# EAGLE design T10_ChargerBase (EAGLE 7.2.0)
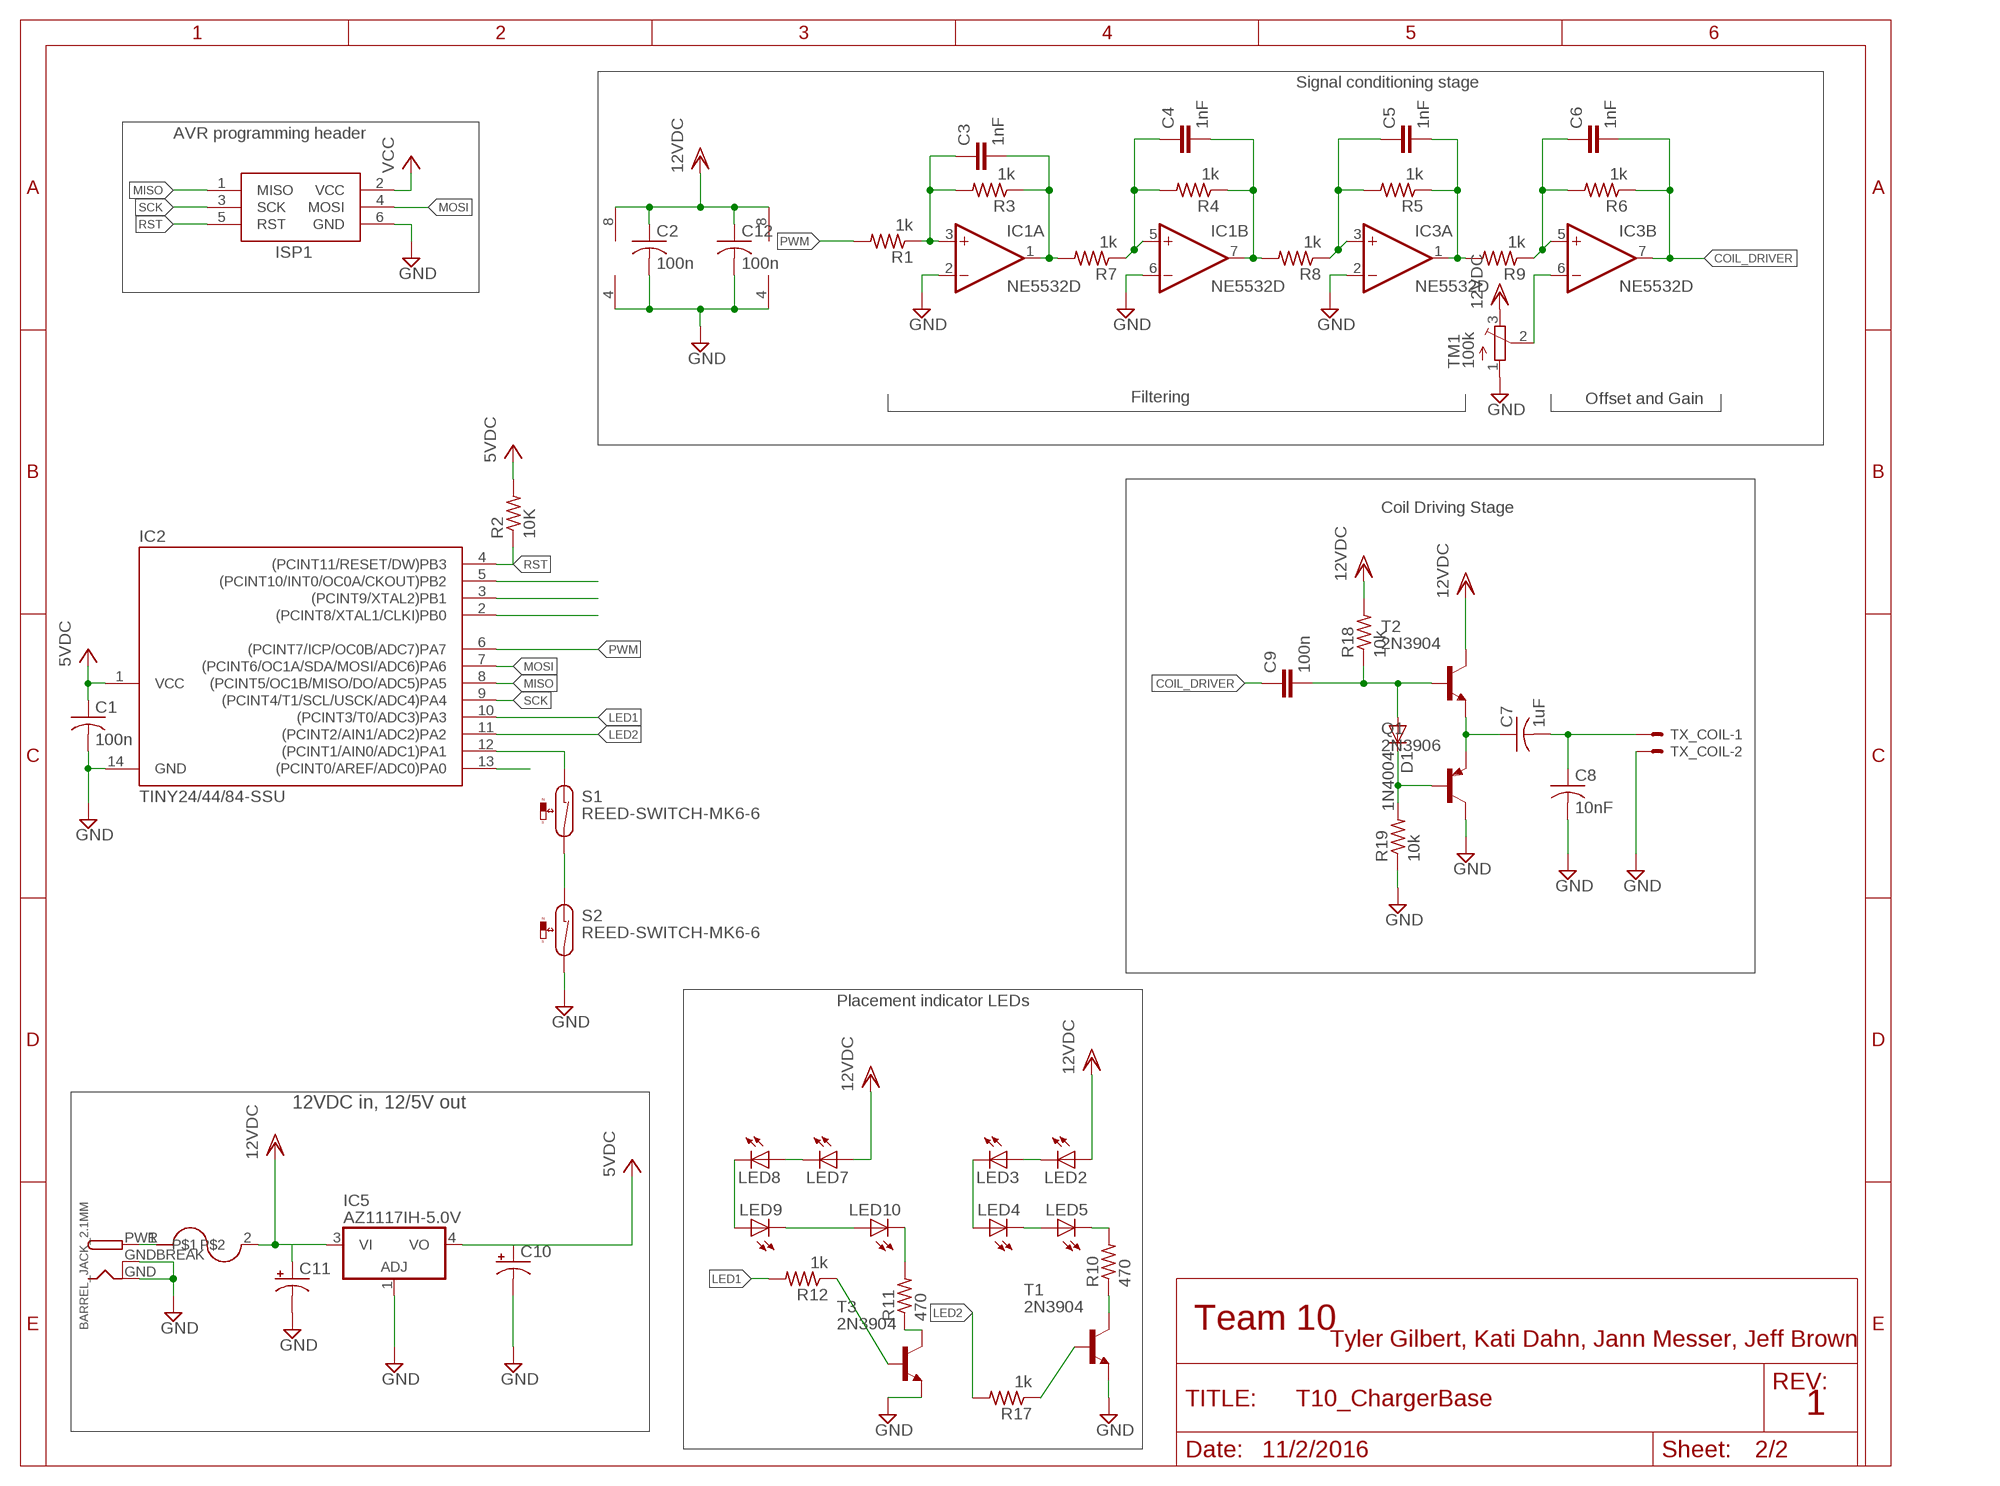
[diagram p0: schematic, sheet 1]

## Parts
BARREL_JACK_2.1MM  DCBARRELPTH  [DCJACK_2MM_PTH]
C1  100n  C-USC0805  [C0805]
C2  100n  C-USC0805  [C0805]
C3  1nF  C-EUC0805  [C0805]
C4  1nF  C-EUC0805  [C0805]
C5  1nF  C-EUC0805  [C0805]
C6  1nF  C-EUC0805  [C0805]
C7  1uF  C-US050-025X075  [C050-025X075]
C8  10nF  C-US050-025X075  [C050-025X075]
C9  100n  C-EUC0805  [C0805]
C10  CPOL-USE2-5  [E2-5]
C11  CPOL-USE2-5  [E2-5]
C12  100n  C-USC0805  [C0805]
D1  1N4004  [DO41-10]
IC1  NE5532D  [SO08]
IC2  TINY24/44/84-SSU  [SOIC14]
IC3  NE5532D  [SO08]
IC5  AZ1117IH-5.0V  317EMP  [SOT223]
ISP1  AVRISP-6  [AVRISP]
LED2  LEDCHIPLED_0805  [CHIPLED_0805]
LED3  LEDCHIPLED_0805  [CHIPLED_0805]
LED4  LEDCHIPLED_0805  [CHIPLED_0805]
LED5  LEDCHIPLED_0805  [CHIPLED_0805]
LED7  LEDCHIPLED_0805  [CHIPLED_0805]
LED8  LEDCHIPLED_0805  [CHIPLED_0805]
LED9  LEDCHIPLED_0805  [CHIPLED_0805]
LED10  LEDCHIPLED_0805  [CHIPLED_0805]
Q1  2N3906  [TO92]
R1  1k  R-US_R0805  [R0805]
R2  10K  R-US_R0805  [R0805]
R3  1k  R-US_R0805  [R0805]
R4  1k  R-US_R0805  [R0805]
R5  1k  R-US_R0805  [R0805]
R6  1k  R-US_R0805  [R0805]
R7  1k  R-US_R0805  [R0805]
R8  1k  R-US_R0805  [R0805]
R9  1k  R-US_R0805  [R0805]
R10  470  R-US_R0805  [R0805]
R11  470  R-US_R0805  [R0805]
R12  1k  R-US_R0805  [R0805]
R17  1k  R-US_R0805  [R0805]
R18  10k  R-US_R0805  [R0805]
R19  10k  R-US_R0805  [R0805]
S1  REED-SWITCH-MK6-6  [MK6-6]
S2  REED-SWITCH-MK6-6  [MK6-6]
T1  2N3904  [TO92]
T2  2N3904  [TO92]
T3  2N3904  [TO92]
TM1  100k  TRIMPOTTC33X  [TC33X]
TX_COIL  22-23-2021  [22-23-2021]
U$1  LITTLEFUSE  [LITTLEFUSE]

## Nets
COIL_DRIVER: C6.2 C9.1 IC3.7(B:OUT) R6.1
GND: BARREL_JACK_2.1MM.GND BARREL_JACK_2.1MM.GNDBREAK C1.2 C2.2 C8.2 C10.- C11.- C12.2 IC1.2(A:-IN) IC1.4(P:V-) IC1.6(B:-IN) IC2.14(GND) IC3.2(A:-IN) IC3.4(P:V-) IC5.1(ADJ) ISP1.6(GND) Q1.1(C) R19.1 S2.2 T1.3(E) T3.3(E) TM1.1(A) TX_COIL.2
LED1: IC2.10((PCINT3/T0/ADC3)PA3) R12.2
LED2: IC2.11((PCINT2/AIN1/ADC2)PA2) R17.2
MISO: IC2.8((PCINT5/OC1B/MISO/DO/ADC5)PA5) ISP1.1(MISO)
MOSI: IC2.7((PCINT6/OC1A/SDA/MOSI/ADC6)PA6) ISP1.4(MOSI)
N$1: C3.1 IC1.3(A:+IN) R1.1 R3.2
N$2: R11.1 T3.1(C)
N$3: IC2.2((PCINT8/XTAL1/CLKI)PB0)
N$4: IC2.3((PCINT9/XTAL2)PB1)
N$5: IC2.5((PCINT10/INT0/OC0A/CKOUT)PB2)
N$6: LED10.C R11.2
N$7: BARREL_JACK_2.1MM.PWR U$1.1
N$8: C3.2 IC1.1(A:OUT) R3.1 R7.2
N$9: C4.1 IC1.5(B:+IN) R4.2 R7.1
N$10: C4.2 IC1.7(B:OUT) R4.1 R8.2
N$11: C5.1 IC3.3(A:+IN) R5.2 R8.1
N$12: C5.2 IC3.1(A:OUT) R5.1 R9.2
N$13: C6.1 IC3.5(B:+IN) R6.2 R9.1
N$14: R17.1 T1.2(B)
N$15: IC3.6(B:-IN) TM1.2(S)
N$16: R10.1 T1.1(C)
N$17: LED5.C R10.2
N$18: LED2.C LED3.A
N$19: LED3.C LED4.A
N$20: LED4.C LED5.A
N$22: S1.2 S2.1
N$24: LED7.C LED8.A
N$25: LED8.C LED9.A
N$26: LED9.C LED10.A
N$27: C7.1 Q1.3(E) T2.3(E)
N$28: C9.2 D1.A R18.1 T2.2(B)
N$29: D1.C Q1.2(B) R19.2
N$30: C7.2 C8.1 TX_COIL.1
N$33: R12.1 T3.2(B)
PIN12: IC2.12((PCINT1/AIN0/ADC1)PA1) S1.1
PIN13: IC2.13((PCINT0/AREF/ADC0)PA0)
PWM: IC2.6((PCINT7/ICP/OC0B/ADC7)PA7) R1.2
RST: IC2.4((PCINT11/RESET/DW)PB3) ISP1.5(RST) R2.1
SCK: IC2.9((PCINT4/T1/SCL/USCK/ADC4)PA4) ISP1.3(SCK)
VCC: C1.1 C10.+ IC2.1(VCC) IC5.4(VO) ISP1.2(VCC) R2.2 ; supply symbol labelled 5VDC
VDD: C2.1 C11.+ C12.1 IC1.8(P:V+) IC3.8(P:V+) IC5.3(VI) LED2.A LED7.A R18.2 T2.1(C) TM1.3(E) U$1.2 ; supply symbol labelled 12VDC

## Notes on the sheet
- Signal conditioning stage
- AVR programming header
- Filtering | Offset and Gain
- Coil Driving Stage
- Placement indicator LEDs
- 12VDC in, 12/5V out

## Library data of the parts
BARREL_JACK_2.1MM = adafruit:DCBARREL: 2.0mm DC Barrel Jack DCJACK_2MM_PTH - Through Hole Jack (4UConnector: 05537)
C1 C2 C12 = rcl:C-US: CAPACITOR, American symbol
C3-C6 C9 = rcl:C-EU: CAPACITOR, European symbol
C7 C8 = adafruit:C-US: CAPACITOR, American symbol
C10 C11 = adafruit:CPOL-US: POLARIZED CAPACITOR, American symbol
D1 = adafruit:1N4004: DIODE General purpose 1N400x type rectifier (With bigger pads) http://www.ladyada.net/library/pcb/eaglelibrary.html
IC1 IC3 = linear:NE5532: AUDIO AMPLIFIER
IC2 = avr-5:TINY24/44/84
IC5 = _VMS:*317: Positive VOLTAGE REGULATOR
ISP1 = adafruit:AVRISP: AVR ISP HEADER Standard 6 pin header for AVR programming
LED2-LED5 LED7-LED10 = led:LED: LED OSRAM: - CHIPLED LG R971, LG N971, LY N971, LG Q971, LY Q971, LO R971, LY R971 LH N974, LH R974 LS Q976, LO Q976, LY Q976 LO Q996 - Hyper CHIPLED LW Q18S LB Q993, LB Q99A, LB R99A - SideLED LS A670, LO A670, LY A670, LG A670, LP A670 LB A673, LV A673, LT A673, LW A673 LH A674 LY A675 LS A676, LA A676, LO A676, LY A676, LW A676 LS A679, LY A679, LG A679 - Hyper Micro SIDELED® LS Y876, LA Y876, LO Y876, LY Y876 LT Y87S - SmartLED LW L88C, LW L88S LB L89C, LB L89S, LG L890 LS L89K, LO L89K, LY L89K LS L896, LA L896, LO L896, LY L896 - TOPLED LS T670, LO T670, LY T670, LG T670, LP T670 LSG T670, LSP T670, LSY T670, LOP T670, LYG T670 LG T671, LOG T671, LSG T671 LB T673, LV T673, LT T673, LW T673 LH T674 LS T676, LA T676, LO T676, LY T676, LB T676, LH T676, LSB T676, LW T676 LB T67C, LV T67C, LT T67C, LS T67K, LO T67K, LY T67K, LW E67C LS E67B, LA E67B, LO E67B, LY E67B, LB E67C, LV E67C, LT E67C LW T67C LS T679, LY T679, LG T679 LS T770, LO T770, LY T770, LG T770, LP T770 LB T773, LV T773, LT T773, LW T773 LH T774 LS E675, LA E675, LY E675, LS T675 LS T776, LA T776, LO T776, LY T776, LB T776 LHGB T686 LT T68C, LB T68C - Hyper Mini TOPLED® LB M676 - Mini TOPLED Santana® LG M470 LS M47K, LO M47K, LY M47K Source: http://www.osram.convergy.de LUXEON: - LUMILED® LXK2-PW12-R00, LXK2-PW12-S00, LXK2-PW14-U00, LXK2-PW14-V00 LXK2-PM12-R00, LXK2-PM12-S00, LXK2-PM14-U00 LXK2-PE12-Q00, LXK2-PE12-R00, LXK2-PE12-S00, LXK2-PE14-T00, LXK2-PE14-U00 LXK2-PB12-K00, LXK2-PB12-L00, LXK2-PB12-M00, LXK2-PB14-N00, LXK2-PB14-P00, LXK2-PB14-Q00 LXK2-PR12-L00, LXK2-PR12-M00, LXK2-PR14-Q00, LXK2-PR14-R00 LXK2-PD12-Q00, LXK2-PD12-R00, LXK2-PD12-S00 LXK2-PH12-R00, LXK2-PH12-S00 LXK2-PL12-P00, LXK2-PL12-Q00, LXK2-PL12-R00 Source: www.luxeon.com KINGBRIGHT: KA-3528ASYC Source: www.kingbright.com
Q1 = transistor-pnp:2N3906: PNP Transistor
R1-R12 R17-R19 = rcl:R-US_: RESISTOR, American symbol
S1 S2 = switch-reed:REED-SWITCH-: Reed Sensor; OC_FARNELL: unknown
T1-T3 = transistor:2N3904: NPN TRANSISTOR
TM1 = adafruit:TRIMPOT: SMT trimmer potentiometer part number TC33X http://www.ladyada.net/library/eagle
TX_COIL = con-molex:22-23-2021: .100" (2.54mm) Center Header - 2 Pin; MF: MOLEX; MPN: 22-23-2021; OC_FARNELL: 1462926; OC_NEWARK: 25C3832
U$1 = _VMS:LITTLEFUSE

## Board
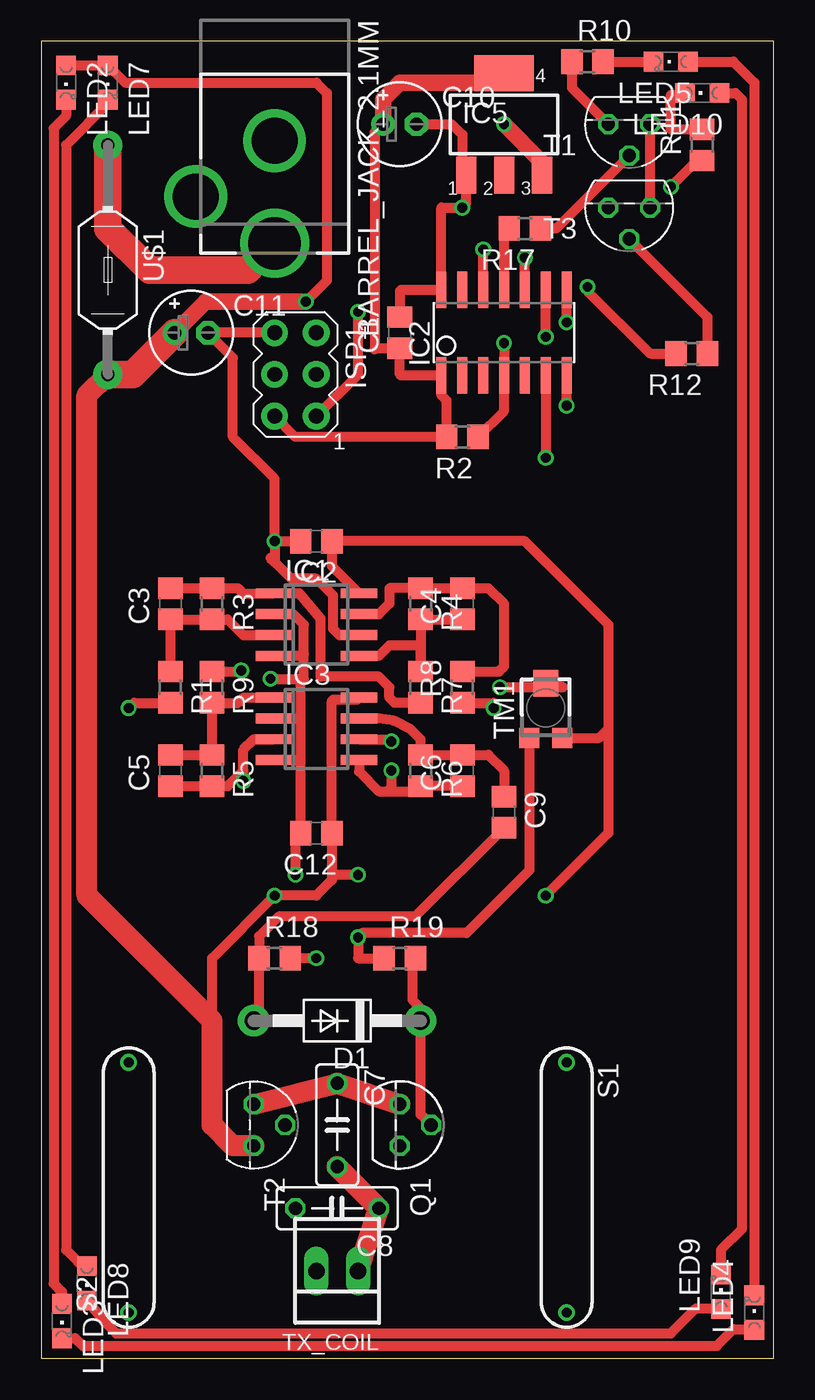
[diagram p1: board, top side]
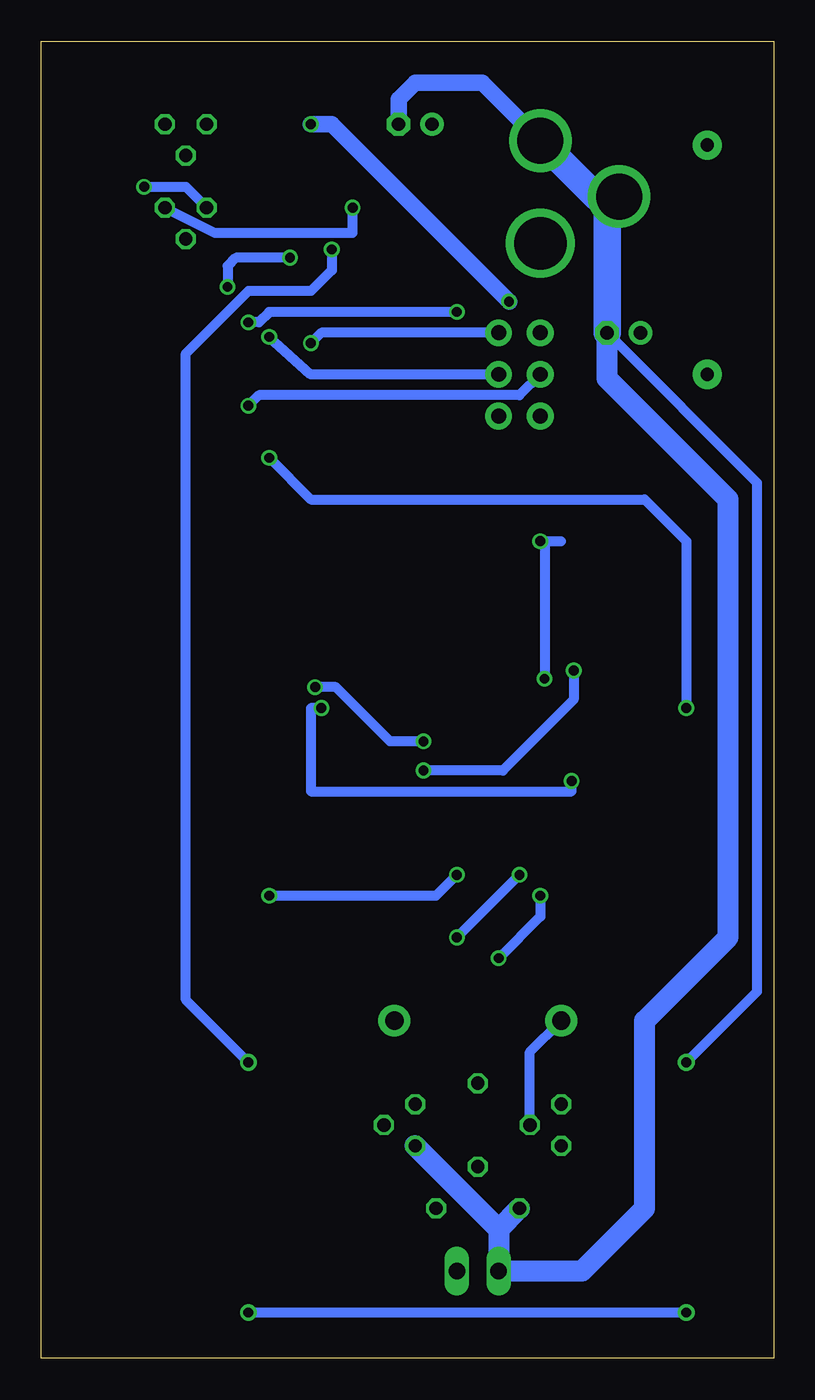
[diagram p2: board, bottom side, seen from below]

Size 44.63 x 80.25 mm. Coordinates in mm from the lower left corner, seen from the top.
Outline: 0,0 44.63,0 44.63,80.25 0,80.25 0,0
Copper layers (1*16): Top 0.0356mm / dielectric 1.5011mm / Bottom 0.0356mm
Design rules "OSHParkDRC": minimum track width 6mil, minimum drill 13mil, track to track 6mil, track to pad 6mil, pad to pad 6mil, via to via 6mil, smd to smd 6mil, copper to edge 15mil, drill to drill 6mil, minimum pad ring 7mil, minimum via ring 7mil, stop-mask expansion 3mil, vias tented up to drill 0mil, thermal gap 10mil

### Footprints (pad centres in the part's own frame; a part is rotated, then mirrored left to right if it is on the bottom)
DCJACK_2MM_PTH = drill 2.8: GND 0,7.35; GNDBREAK 4.8,10.75 | drill 3.2: PWR 0,13.6
C0805 = smd 1.3 x 1.5: 1 -0.95,0; 2 0.95,0
C050-025X075 = drill 0.813 octagon: 1 -2.54,0; 2 2.54,0
E2-5 = drill 0.813 pad 1.422: + -1.016,0 | drill 0.813 pad 1.422 octagon: - 1.016,0
DO41-10 = drill 1.118 pad 1.93: A 5.08,0; C -5.08,0
SO08 = smd 0.6 x 2.2: 1 -1.905,-2.6; 2 -0.635,-2.6; 3 0.635,-2.6; 4 1.905,-2.6; 5 1.905,2.6; 6 0.635,2.6; 7 -0.635,2.6; 8 -1.905,2.6
SOIC14 = smd 0.61 x 2.21: 1 -3.81,-2.603; 2 -2.54,-2.603; 3 -1.27,-2.603; 4 0,-2.603; 5 1.27,-2.603; 6 2.54,-2.603; 7 3.81,-2.603; 8 3.81,2.603; 9 2.54,2.603; 10 1.27,2.603; 11 0,2.603; 12 -1.27,2.603; 13 -2.54,2.603; 14 -3.81,2.603
SOT223 = smd 1.219 x 2.235: 1 -2.311,-3.099; 2 0,-3.099; 3 2.311,-3.099 | smd 3.6 x 2.2: 4 0,3.099
AVRISP = drill 0.9 pad 1.626: 1 -1.27,2.54; 2 1.27,2.54; 3 -1.27,0; 4 1.27,0; 5 -1.27,-2.54; 6 1.27,-2.54
CHIPLED_0805 = smd 1.2 x 1.2: A 0,-1.05; C 0,1.05
TO92 = drill 0.813 octagon: 1 1.27,0; 2 0,1.905; 3 -1.27,0
R0805 = smd 1.3 x 1.5: 1 -0.95,0; 2 0.95,0
MK6-6 = drill 0.6 pad 1.016: 1 -7.62,0; 2 7.62,0
TC33X = smd 1.2 x 1.2: 1 -1,-1.825; 3 1,-1.825 | smd 1.5 x 1.6: 2 0,1.5
22-23-2021 = drill 1 long: 1 -1.27,0; 2 1.27,0
LITTLEFUSE = drill 0.813 pad 1.778: 1 -7.62,0; 2 6.35,0

### Placement (x,y rotation side)
BARREL_JACK_2.1MM  14.22,81.53 180 top
C1  21.84,62.48 90 top
C2  16.76,49.78 180 top
C3  7.87,45.97 90 top
C4  25.65,45.97 90 top
C5  7.87,35.81 90 top
C6  25.65,35.81 90 top
C7  18.03,14.22 270 top
C8  18.03,9.14 180 top
C9  28.19,33.27 270 top
C10  21.84,75.18 0 top
C11  9.14,62.48 0 top
C12  16.76,32 180 top
D1  18.03,20.57 180 top
IC1  16.76,44.7 270 top
IC2  28.19,62.48 0 top
IC3  16.76,38.35 270 top
IC5  28.19,75.18 0 top
ISP1  15.49,59.94 180 top
LED2  1.52,77.72 180 top
LED3  1.27,2.29 180 top
LED4  43.43,2.79 0 top
LED5  38.35,78.99 90 top
LED7  4.06,77.72 180 top
LED8  2.79,4.57 180 top
LED9  41.4,4.06 0 top
LED10  40.26,77.09 90 top
Q1  21.84,14.22 270 top
R1  7.87,40.89 270 top
R2  25.65,56.13 180 top
R3  10.41,45.97 270 top
R4  23.11,45.97 270 top
R5  10.41,35.81 270 top
R6  23.11,35.81 270 top
R7  23.11,40.89 270 top
R8  25.65,40.89 90 top
R9  10.41,40.89 270 top
R10  33.27,78.99 0 top
R11  40.26,73.91 90 top
R12  39.62,61.21 180 top
R17  29.46,68.83 180 top
R18  14.22,24.38 0 top
R19  21.84,24.38 0 top
S1  32,10.41 270 top
S2  5.33,10.41 90 top
T1  35.81,75.18 180 top
T2  12.95,14.22 270 top
T3  35.81,70.1 180 top
TM1  30.73,39.62 0 top
TX_COIL  18.03,5.33 180 top
U$1  4.06,66.29 270 top

### Tracks (layer width: path | path; a pad name or v marks a point on that pad's centre or on a via)
COIL_DRIVER
  Top 0.61: IC3.7 20.57,38.99 21.46,38.86 22.48,38.35 23.11,37.72 R6.1 C6.2 27.24,36.76 28.19,35.81 C9.1
GND  (via drill 0.6)
  Top 0.61: C1.2 21.84,65.02 21.91,65.09 IC2.14 24.38,70.1 v25.65,70.1 25.88,70.33 IC5.1 25.65,72.31 25.65,74.55 25.02,75.18 C10.- | ISP1.6 C11.- 11.68,60.96 11.68,56.13 14.22,53.59 v14.22,49.78 | T3.3 T1.3 | 16,42.93 16,44.7 15.37,45.34 IC1.2 | v13.97,41.4 16,41.4 | 16,41.4 16,42.93 | 16,42.93 15.88,42.8 IC1.4 | 15.81,36.58 C12.2 15.49,31.68 v15.49,29.46 | 15.81,36.58 15.81,38.86 | 15.81,38.86 15.81,41.21 16,41.4 | IC3.2 15.69,38.99 15.81,38.86 | IC3.4 15.69,36.45 15.81,36.58 | v14.22,49.78 C2.2 | IC1.6 18.16,44.07 17.78,44.45 17.78,46.48 16.76,47.5 15.24,47.5 14.22,48.51 | 14.22,48.51 13.97,48.77 | R19.1 19.3,24.38 v19.3,25.65 19.56,25.91 25.91,25.91 29.73,29.73 TM1.1 | v14.22,49.78 14.22,48.51
  Bottom 0.61: T3.3 34.04,68.58 25.65,68.58 v25.65,70.1 | 13.97,49.78 v13.97,41.4 | S2.2 1.02,22.35 1.02,53.34 C11.- | v15.49,29.46 v19.3,25.65 | 13.97,49.78 12.95,49.78 | 13.97,49.78 v14.22,49.78
  Bottom 1.016: C10.- 22.86,76.71 21.84,77.72 17.76,77.72 BARREL_JACK_2.1MM.GND
  Bottom 1.27: C11.- 10.16,59.69 2.79,52.32 2.79,25.65 7.87,20.57 7.87,9.14 11.68,5.33 TX_COIL.2 16.76,7.87 | Q1.1 16.76,7.87 | C8.2 16.76,7.87
  Bottom 1.676: C11.- 10.16,70.05 BARREL_JACK_2.1MM.GNDBREAK 10.82,70.78 BARREL_JACK_2.1MM.GND
LED1  (via drill 0.6)
  Top 0.61: IC2.10 v29.46,67.06 | v33.27,65.28 33.27,65.02 37.08,61.21 R12.2
  Bottom 0.61: v29.46,67.06 32.77,67.06 33.27,66.55 v33.27,65.28
LED2
  Top 0.61: IC2.11 28.19,68.51 R17.2
MISO  (via drill 0.6)
  Top 0.61: ISP1.1 19.3,59.94 v19.3,63.75 | v32,63.12 IC2.8
  Bottom 0.61: v19.3,63.75 30.73,63.75 31.37,63.12 v32,63.12
MOSI  (via drill 0.6)
  Top 0.61: v32,58.04 IC2.7
  Bottom 0.61: ISP1.4 15.49,58.67 31.37,58.67 v32,58.04
N$1
  Top 0.61: IC1.3 12.32,44.07 11.36,45.02 R3.2 C3.1 R1.1
N$2  (via drill 0.6)
  Top 0.61: R11.1 39.94,72.96 v38.35,71.37
  Bottom 0.61: v38.35,71.37 35.81,71.37 T3.1
N$6
  Top 0.61: R11.2 38.35,74.86 38.35,76.96 39.21,76.96 LED10.C
N$7
  Top 1.676: U$1.1 4.06,68.83 6.6,66.29 12.58,66.29 BARREL_JACK_2.1MM.PWR
N$8
  Top 0.61: C3.2 R3.1 12,46.92 12.32,46.61 IC1.1 15.75,46.61 17.02,45.09 17.02,41.53 20.57,41.53 21.21,40.89 21.21,40.26 21.52,39.94 R7.2
N$9
  Top 0.61: C4.1 R4.2 R7.1 23.11,43.43 21.21,43.43 20.57,42.8 IC1.5
N$10
  Top 0.61: R8.2 27.87,41.84 28.19,42.16 28.19,45.97 27.24,46.92 C4.2 R4.1 21.21,46.92 21.21,45.97 20.57,45.34 IC1.7
N$11  (via drill 0.6)
  Top 0.61: C5.1 R5.2 11.37,34.86 12.32,35.81 | 12.32,35.81 12.32,37.08 12.95,37.72 IC3.3 | R8.1 27.56,39.94 v27.56,39.62 | v12.32,35.18 12.32,35.81
  Bottom 0.61: v27.56,39.62 28.19,39.62 28.19,34.54 12.32,34.54 v12.32,35.18
N$12
  Top 0.61: IC3.1 12.32,40.26 12,39.94 R9.2 R5.1 C5.2
N$13  (via drill 0.6)
  Top 0.61: C6.1 R6.2 22.79,34.54 21.08,34.54 | IC3.5 19.36,35.75 20.57,34.54 21.08,34.54 | R9.1 12.13,41.84 v12.19,41.91 | v21.34,35.81 21.34,34.8 21.08,34.54
  Bottom 0.61: v12.19,41.91 12.19,40.13 16.51,35.81 v21.34,35.81
N$14
  Top 0.61: T1.2 31.37,68.83 R17.1
N$15  (via drill 0.6)
  Top 0.61: IC3.6 21.21,37.72 v21.34,37.59 | v27.94,40.89 31.77,40.89 TM1.2
  Bottom 0.61: v21.34,37.59 23.37,37.59 26.67,40.89 v27.94,40.89
N$16
  Top 0.61: R10.1 32.32,77.4 T1.1
N$17
  Top 0.61: R10.2 LED5.C
N$18
  Top 0.61: LED2.C 1.52,75.69 0.76,74.93 0.76,4.57 1.27,4.06 LED3.A
N$19
  Top 0.61: LED3.C 2.07,1.24 2.54,0.76 41.15,0.76 42.16,1.78 43.4,1.78 LED4.A
N$20
  Top 0.61: LED5.A 42.16,78.99 43.43,77.72 LED4.C
N$22
  Bottom 0.61: S2.1 S1.2
N$24
  Top 0.61: LED7.C 4.06,76.45 1.52,73.91 1.52,6.6 2.79,5.33 LED8.A
N$25
  Top 0.61: LED8.C 3.84,2.25 4.57,1.52 38.35,1.52 39.88,3.05 41.37,3.05 LED9.A
N$26
  Top 0.61: LED10.A 42.29,77.09 42.67,76.71 42.67,7.87 41.4,6.6 LED9.C
N$27
  Top 1.27: Q1.3 C7.1 T2.3
N$28
  Top 0.61: D1.A 13.27,20.89 R18.1 13.27,25.72 14.48,26.92 22.79,26.92 C9.2
  Bottom 0.61: T2.2 14.86,18.67 D1.A
N$29
  Top 0.61: R19.2 22.61,24.2 22.61,21.84 23.11,21.34 D1.C 23.11,14.86 Q1.2
N$30
  Top 1.27: TX_COIL.1 C8.1 C7.2
N$33
  Top 0.61: T3.2 40.57,63.44 R12.1
PIN12  (via drill 0.6)
  Top 0.61: IC2.12 v26.92,67.56
  Bottom 0.61: S1.1 35.81,21.84 35.81,61.21 32,65.02 28.19,65.02 26.92,66.29 v26.92,67.56
PWM  (via drill 0.6)
  Top 0.61: IC2.6 v30.73,54.86 | v5.33,39.62 5.65,39.94 R1.2
  Bottom 0.61: v30.73,54.86 28.19,52.32 7.87,52.32 5.33,49.78 v5.33,39.62
RST  (via drill 0.6)
  Top 0.61: R2.1 28.19,57.72 IC2.4 v28.19,61.85
  Bottom 0.61: ISP1.5 27.56,62.48 v28.19,61.85
SCK  (via drill 0.6)
  Top 0.61: v30.73,62.23 IC2.9
  Bottom 0.61: ISP1.3 28.19,59.94 v30.73,62.23
VCC
  Top 0.61: ISP1.2 15.49,56.13 R2.2 24.7,58.35 24.38,58.67 IC2.1 21.91,59.88 21.84,59.94 C1.1 20.39,61.53 20.32,61.47 20.32,74.68 C10.+
  Top 1.016: C10.+ 20.83,76.71 21.84,77.72 27.64,77.72 IC5.4
VDD  (via drill 0.6)
  Top 0.61: C11.+ 8.13,62.74 9.14,63.75 | IC3.8 19.24,40.13 17.78,40.13 17.71,40.07 C12.1 17.71,29.46 | IC1.8 17.71,48.26 C2.1 29.46,49.78 34.54,44.7 34.54,38.35 | LED2.A LED7.A 5.11,77.72 16.76,77.72 17.4,77.09 17.4,65.66 v16.13,64.39 | 17.71,29.46 17.71,29.14 16.76,28.19 v14.22,28.19 10.41,24.38 10.41,20.57 | v16.76,24.38 R18.2 | 34.54,38.35 34.54,32 v30.73,28.19 | v19.3,29.46 17.71,29.46 | TM1.3 33.99,37.8 34.54,38.35
  Top 1.016: IC5.3 30.51,72.87 v28.19,75.18 | v16.13,64.39 10.03,64.39 C11.+
  Top 1.27: T2.1 11.68,12.95 10.41,14.22 10.41,20.57 2.79,28.19 2.79,58.67 U$1.2
  Top 1.676: U$1.2 5.59,59.94 C11.+
  Bottom 0.61: v14.22,28.19 14.22,26.92 v16.76,24.38 | v30.73,28.19 20.57,28.19 v19.3,29.46
  Bottom 1.016: v28.19,75.18 26.92,75.18 v16.13,64.39